# EAGLE design light-plate_leds_v1.0 (EAGLE 6.2)

## Sheet 1 of 4
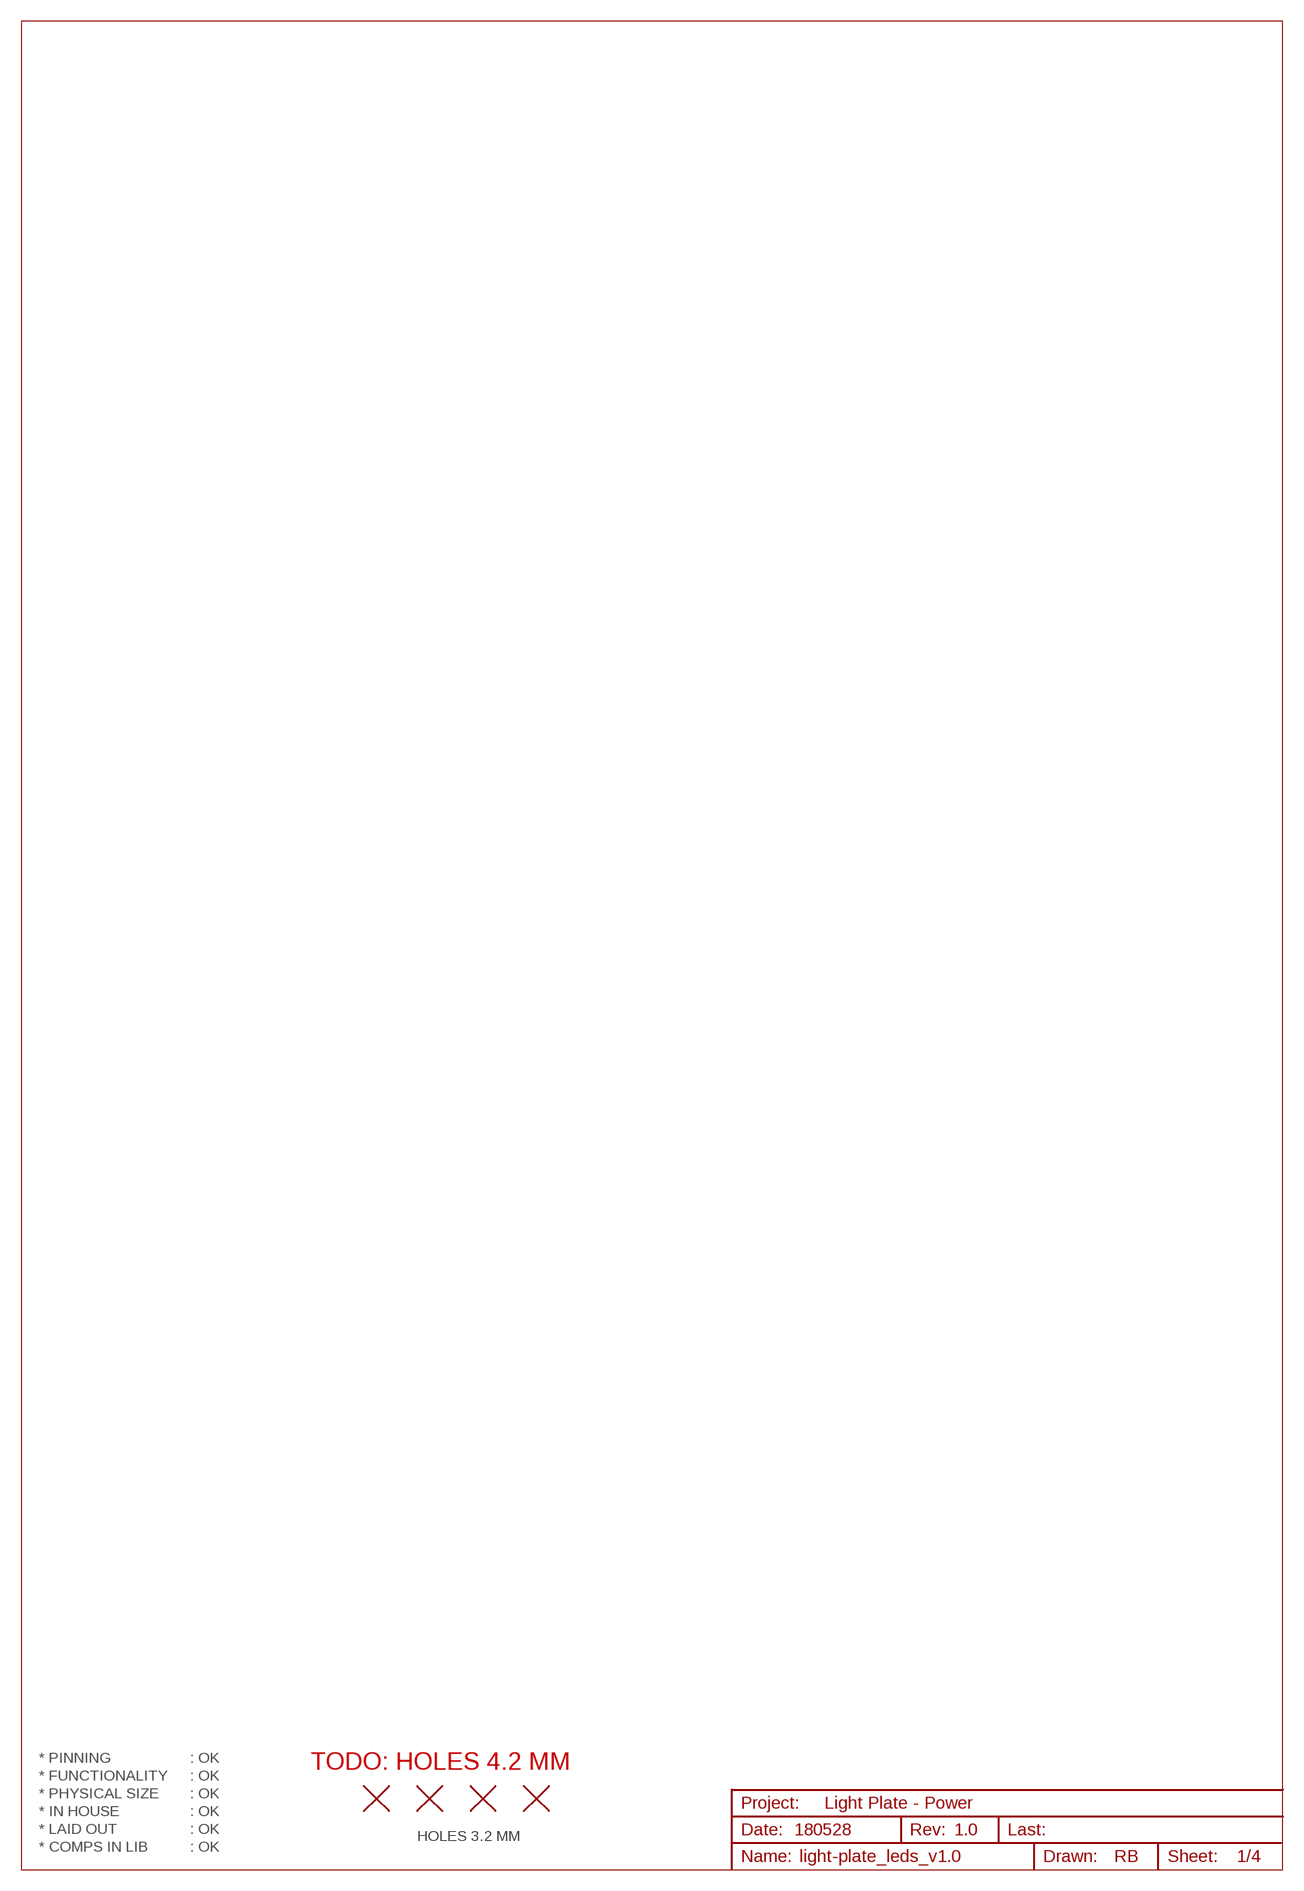
[diagram p0: schematic, sheet 1]

### Parts
H1  HOLE_NPTH_3.2MM  [HOLE_NPTH_3.2MM]
H2  HOLE_NPTH_3.2MM  [HOLE_NPTH_3.2MM]
H3  HOLE_NPTH_3.2MM  [HOLE_NPTH_3.2MM]
H4  HOLE_NPTH_3.2MM  [HOLE_NPTH_3.2MM]

### Notes on the sheet
- * PINNING | : OK
- TODO: HOLES 4.2 MM
- * FUNCTIONALITY | : OK
- * PHYSICAL SIZE | : OK
- Light Plate - Power
- * IN HOUSE | : OK
- * LAID OUT | : OK | 180528 | 1.0
- HOLES 3.2 MM
- * COMPS IN LIB | : OK

## Sheet 2 of 4
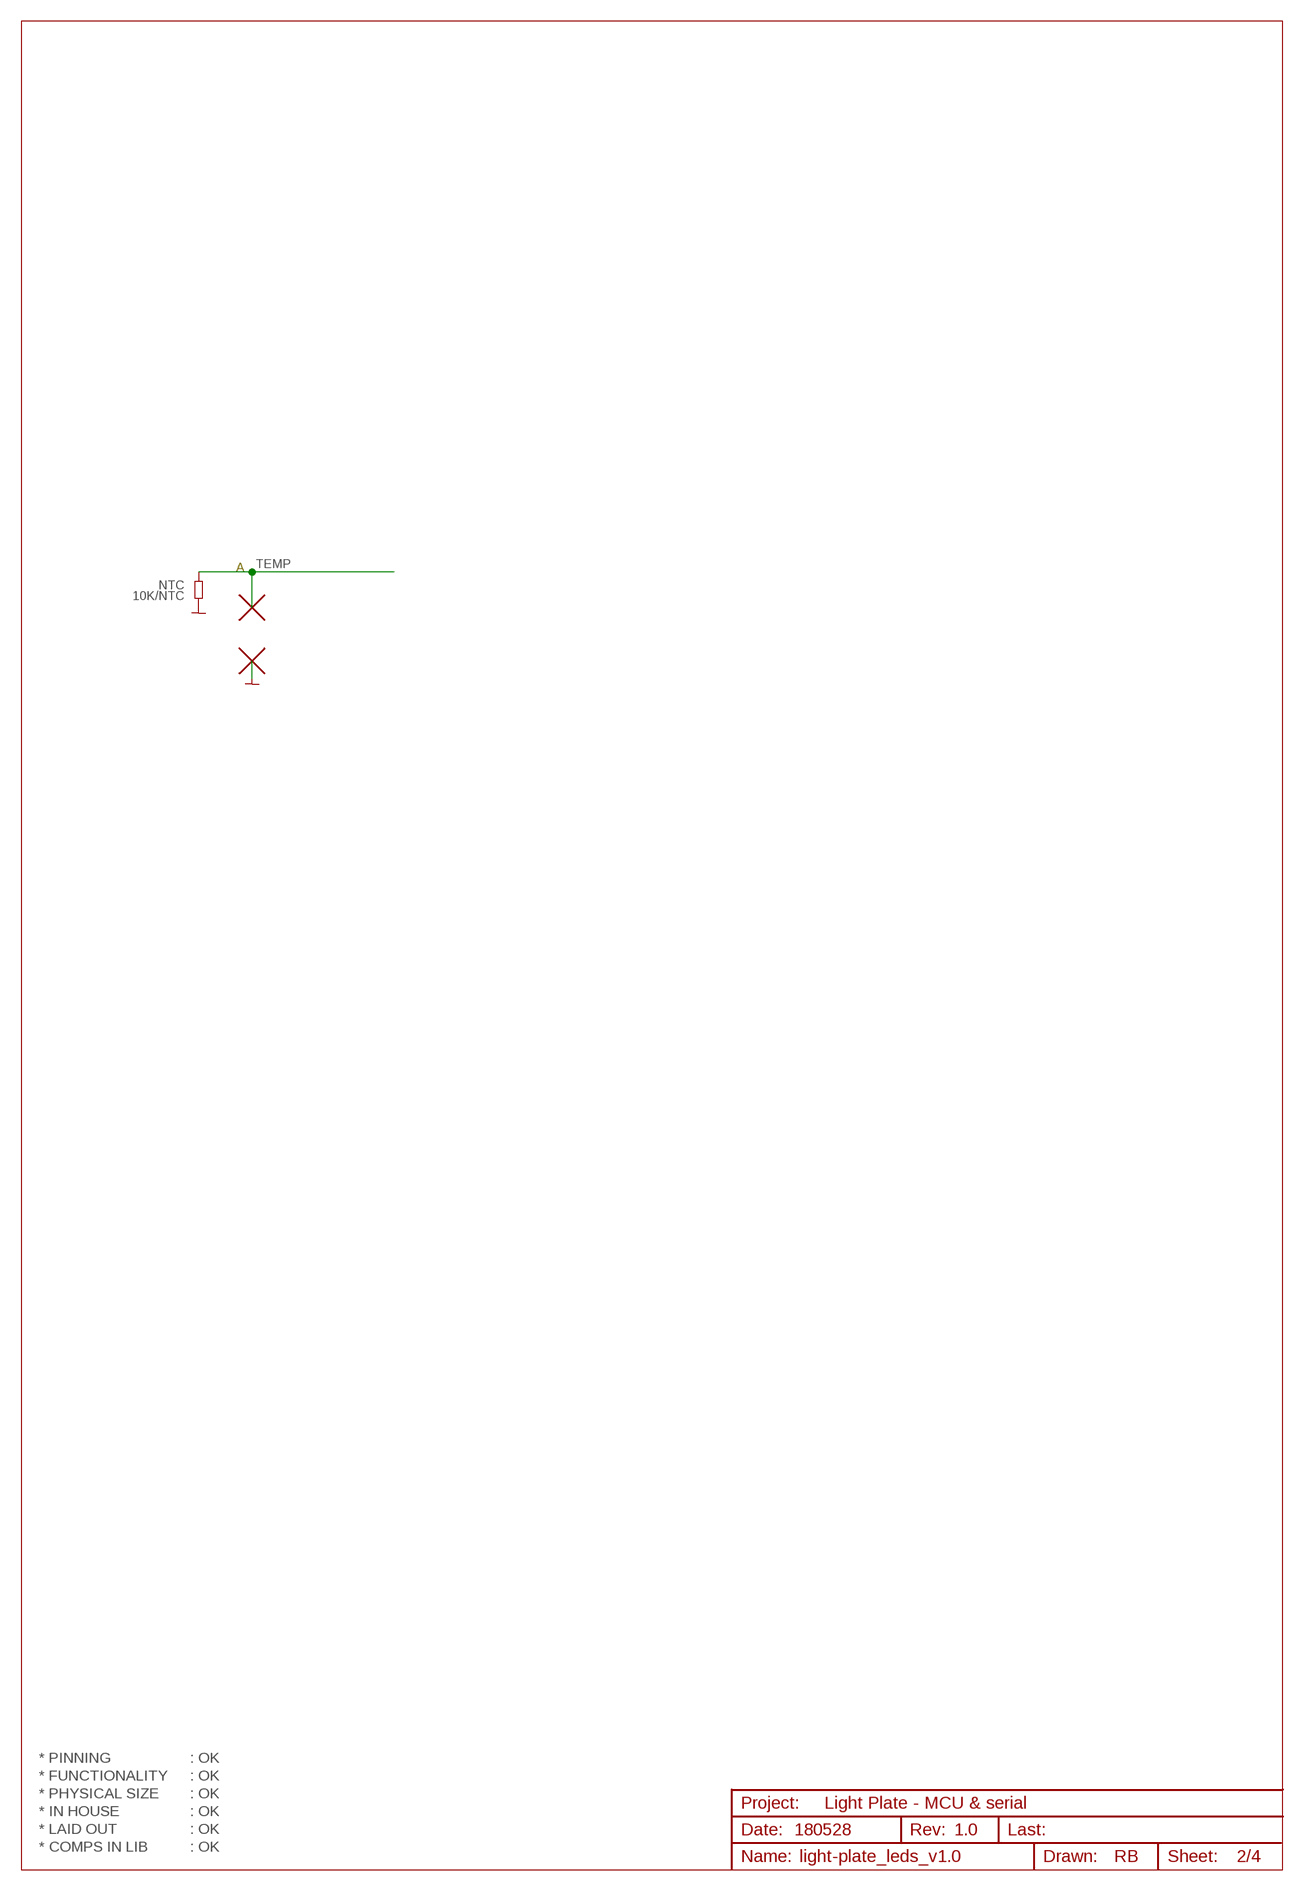
[diagram p1: schematic, sheet 2]

### Parts
H11  PAD_ROUND_1.6MM  [PAD_ROUND_1.6MM]
H12  PAD_ROUND_1.6MM  [PAD_ROUND_1.6MM]
NTC  10K/NTC  RES0603  [RES0603]

### Nets
GND: H11.P NTC.1
TEMP: H12.P NTC.2

### Notes on the sheet
- A
- * PINNING | : OK
- * FUNCTIONALITY | : OK
- * PHYSICAL SIZE | : OK
- Light Plate - MCU & serial
- * IN HOUSE | : OK
- * LAID OUT | : OK | 180528 | 1.0
- * COMPS IN LIB | : OK

## Sheet 3 of 4
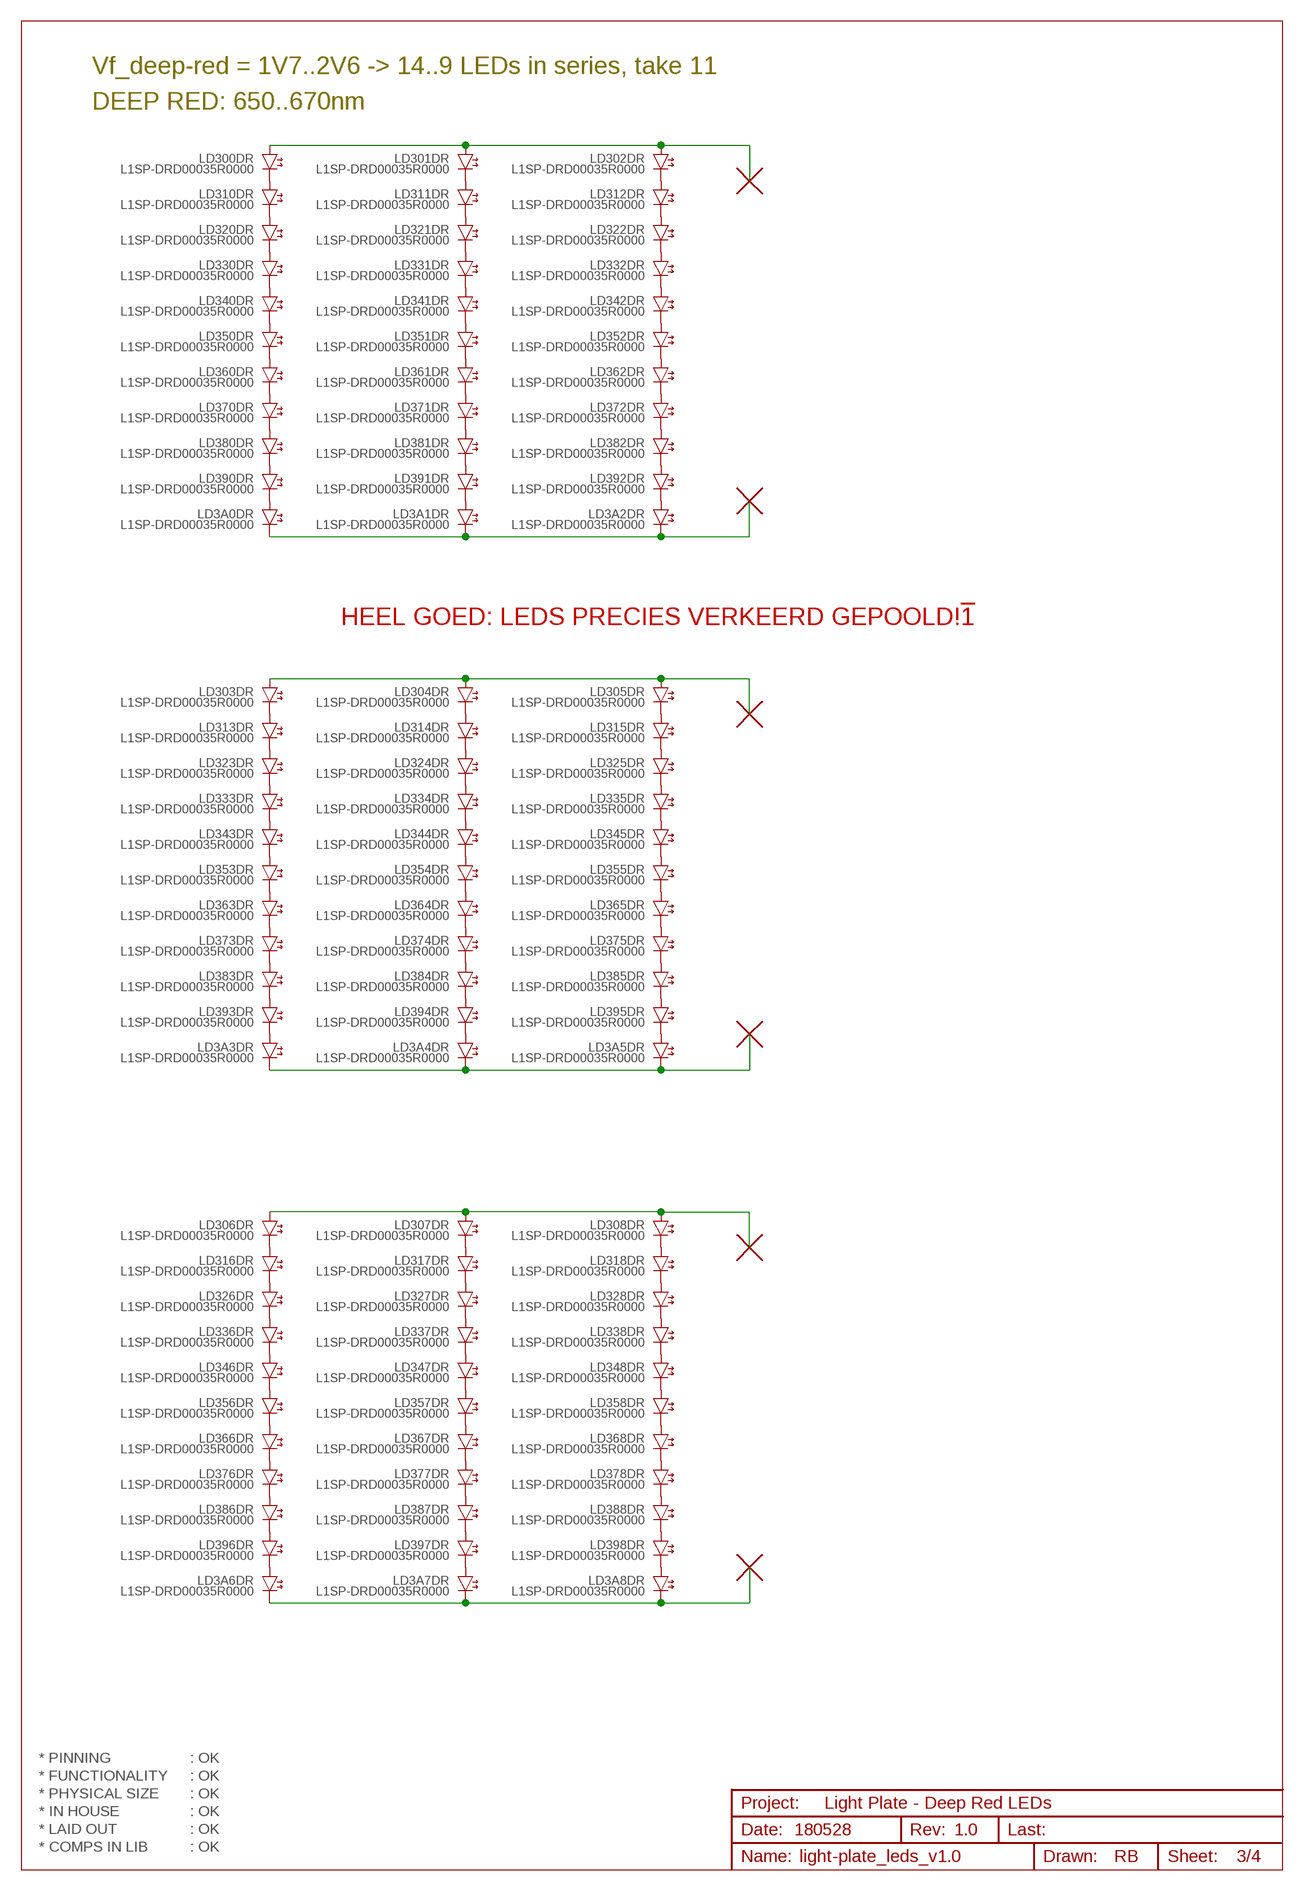
[diagram p2: schematic, sheet 3]

### Parts
H17  PAD_ROUND_3.2MM  [PAD_ROUND_3.2MM]
H18  PAD_ROUND_3.2MM  [PAD_ROUND_3.2MM]
H19  PAD_ROUND_3.2MM  [PAD_ROUND_3.2MM]
H20  PAD_ROUND_3.2MM  [PAD_ROUND_3.2MM]
H21  PAD_ROUND_3.2MM  [PAD_ROUND_3.2MM]
H22  PAD_ROUND_3.2MM  [PAD_ROUND_3.2MM]
LD3A0DR  L1SP-DRD00035R0000  LED_SMD_SUNPLUS35_REVERSED  [LED_SMD_SUNPLUS35_REVERSED]
LD3A1DR  L1SP-DRD00035R0000  LED_SMD_SUNPLUS35_REVERSED  [LED_SMD_SUNPLUS35_REVERSED]
LD3A2DR  L1SP-DRD00035R0000  LED_SMD_SUNPLUS35_REVERSED  [LED_SMD_SUNPLUS35_REVERSED]
LD3A3DR  L1SP-DRD00035R0000  LED_SMD_SUNPLUS35_REVERSED  [LED_SMD_SUNPLUS35_REVERSED]
LD3A4DR  L1SP-DRD00035R0000  LED_SMD_SUNPLUS35_REVERSED  [LED_SMD_SUNPLUS35_REVERSED]
LD3A5DR  L1SP-DRD00035R0000  LED_SMD_SUNPLUS35_REVERSED  [LED_SMD_SUNPLUS35_REVERSED]
LD3A6DR  L1SP-DRD00035R0000  LED_SMD_SUNPLUS35_REVERSED  [LED_SMD_SUNPLUS35_REVERSED]
LD3A7DR  L1SP-DRD00035R0000  LED_SMD_SUNPLUS35_REVERSED  [LED_SMD_SUNPLUS35_REVERSED]
LD3A8DR  L1SP-DRD00035R0000  LED_SMD_SUNPLUS35_REVERSED  [LED_SMD_SUNPLUS35_REVERSED]
LD300DR  L1SP-DRD00035R0000  LED_SMD_SUNPLUS35_REVERSED  [LED_SMD_SUNPLUS35_REVERSED]
LD301DR  L1SP-DRD00035R0000  LED_SMD_SUNPLUS35_REVERSED  [LED_SMD_SUNPLUS35_REVERSED]
LD302DR  L1SP-DRD00035R0000  LED_SMD_SUNPLUS35_REVERSED  [LED_SMD_SUNPLUS35_REVERSED]
LD303DR  L1SP-DRD00035R0000  LED_SMD_SUNPLUS35_REVERSED  [LED_SMD_SUNPLUS35_REVERSED]
LD304DR  L1SP-DRD00035R0000  LED_SMD_SUNPLUS35_REVERSED  [LED_SMD_SUNPLUS35_REVERSED]
LD305DR  L1SP-DRD00035R0000  LED_SMD_SUNPLUS35_REVERSED  [LED_SMD_SUNPLUS35_REVERSED]
LD306DR  L1SP-DRD00035R0000  LED_SMD_SUNPLUS35_REVERSED  [LED_SMD_SUNPLUS35_REVERSED]
LD307DR  L1SP-DRD00035R0000  LED_SMD_SUNPLUS35_REVERSED  [LED_SMD_SUNPLUS35_REVERSED]
LD308DR  L1SP-DRD00035R0000  LED_SMD_SUNPLUS35_REVERSED  [LED_SMD_SUNPLUS35_REVERSED]
LD310DR  L1SP-DRD00035R0000  LED_SMD_SUNPLUS35_REVERSED  [LED_SMD_SUNPLUS35_REVERSED]
LD311DR  L1SP-DRD00035R0000  LED_SMD_SUNPLUS35_REVERSED  [LED_SMD_SUNPLUS35_REVERSED]
LD312DR  L1SP-DRD00035R0000  LED_SMD_SUNPLUS35_REVERSED  [LED_SMD_SUNPLUS35_REVERSED]
LD313DR  L1SP-DRD00035R0000  LED_SMD_SUNPLUS35_REVERSED  [LED_SMD_SUNPLUS35_REVERSED]
LD314DR  L1SP-DRD00035R0000  LED_SMD_SUNPLUS35_REVERSED  [LED_SMD_SUNPLUS35_REVERSED]
LD315DR  L1SP-DRD00035R0000  LED_SMD_SUNPLUS35_REVERSED  [LED_SMD_SUNPLUS35_REVERSED]
LD316DR  L1SP-DRD00035R0000  LED_SMD_SUNPLUS35_REVERSED  [LED_SMD_SUNPLUS35_REVERSED]
LD317DR  L1SP-DRD00035R0000  LED_SMD_SUNPLUS35_REVERSED  [LED_SMD_SUNPLUS35_REVERSED]
LD318DR  L1SP-DRD00035R0000  LED_SMD_SUNPLUS35_REVERSED  [LED_SMD_SUNPLUS35_REVERSED]
LD320DR  L1SP-DRD00035R0000  LED_SMD_SUNPLUS35_REVERSED  [LED_SMD_SUNPLUS35_REVERSED]
LD321DR  L1SP-DRD00035R0000  LED_SMD_SUNPLUS35_REVERSED  [LED_SMD_SUNPLUS35_REVERSED]
LD322DR  L1SP-DRD00035R0000  LED_SMD_SUNPLUS35_REVERSED  [LED_SMD_SUNPLUS35_REVERSED]
LD323DR  L1SP-DRD00035R0000  LED_SMD_SUNPLUS35_REVERSED  [LED_SMD_SUNPLUS35_REVERSED]
LD324DR  L1SP-DRD00035R0000  LED_SMD_SUNPLUS35_REVERSED  [LED_SMD_SUNPLUS35_REVERSED]
LD325DR  L1SP-DRD00035R0000  LED_SMD_SUNPLUS35_REVERSED  [LED_SMD_SUNPLUS35_REVERSED]
LD326DR  L1SP-DRD00035R0000  LED_SMD_SUNPLUS35_REVERSED  [LED_SMD_SUNPLUS35_REVERSED]
LD327DR  L1SP-DRD00035R0000  LED_SMD_SUNPLUS35_REVERSED  [LED_SMD_SUNPLUS35_REVERSED]
LD328DR  L1SP-DRD00035R0000  LED_SMD_SUNPLUS35_REVERSED  [LED_SMD_SUNPLUS35_REVERSED]
LD330DR  L1SP-DRD00035R0000  LED_SMD_SUNPLUS35_REVERSED  [LED_SMD_SUNPLUS35_REVERSED]
LD331DR  L1SP-DRD00035R0000  LED_SMD_SUNPLUS35_REVERSED  [LED_SMD_SUNPLUS35_REVERSED]
LD332DR  L1SP-DRD00035R0000  LED_SMD_SUNPLUS35_REVERSED  [LED_SMD_SUNPLUS35_REVERSED]
LD333DR  L1SP-DRD00035R0000  LED_SMD_SUNPLUS35_REVERSED  [LED_SMD_SUNPLUS35_REVERSED]
LD334DR  L1SP-DRD00035R0000  LED_SMD_SUNPLUS35_REVERSED  [LED_SMD_SUNPLUS35_REVERSED]
LD335DR  L1SP-DRD00035R0000  LED_SMD_SUNPLUS35_REVERSED  [LED_SMD_SUNPLUS35_REVERSED]
LD336DR  L1SP-DRD00035R0000  LED_SMD_SUNPLUS35_REVERSED  [LED_SMD_SUNPLUS35_REVERSED]
LD337DR  L1SP-DRD00035R0000  LED_SMD_SUNPLUS35_REVERSED  [LED_SMD_SUNPLUS35_REVERSED]
LD338DR  L1SP-DRD00035R0000  LED_SMD_SUNPLUS35_REVERSED  [LED_SMD_SUNPLUS35_REVERSED]
LD340DR  L1SP-DRD00035R0000  LED_SMD_SUNPLUS35_REVERSED  [LED_SMD_SUNPLUS35_REVERSED]
LD341DR  L1SP-DRD00035R0000  LED_SMD_SUNPLUS35_REVERSED  [LED_SMD_SUNPLUS35_REVERSED]
LD342DR  L1SP-DRD00035R0000  LED_SMD_SUNPLUS35_REVERSED  [LED_SMD_SUNPLUS35_REVERSED]
LD343DR  L1SP-DRD00035R0000  LED_SMD_SUNPLUS35_REVERSED  [LED_SMD_SUNPLUS35_REVERSED]
LD344DR  L1SP-DRD00035R0000  LED_SMD_SUNPLUS35_REVERSED  [LED_SMD_SUNPLUS35_REVERSED]
LD345DR  L1SP-DRD00035R0000  LED_SMD_SUNPLUS35_REVERSED  [LED_SMD_SUNPLUS35_REVERSED]
LD346DR  L1SP-DRD00035R0000  LED_SMD_SUNPLUS35_REVERSED  [LED_SMD_SUNPLUS35_REVERSED]
LD347DR  L1SP-DRD00035R0000  LED_SMD_SUNPLUS35_REVERSED  [LED_SMD_SUNPLUS35_REVERSED]
LD348DR  L1SP-DRD00035R0000  LED_SMD_SUNPLUS35_REVERSED  [LED_SMD_SUNPLUS35_REVERSED]
LD350DR  L1SP-DRD00035R0000  LED_SMD_SUNPLUS35_REVERSED  [LED_SMD_SUNPLUS35_REVERSED]
LD351DR  L1SP-DRD00035R0000  LED_SMD_SUNPLUS35_REVERSED  [LED_SMD_SUNPLUS35_REVERSED]
LD352DR  L1SP-DRD00035R0000  LED_SMD_SUNPLUS35_REVERSED  [LED_SMD_SUNPLUS35_REVERSED]
LD353DR  L1SP-DRD00035R0000  LED_SMD_SUNPLUS35_REVERSED  [LED_SMD_SUNPLUS35_REVERSED]
LD354DR  L1SP-DRD00035R0000  LED_SMD_SUNPLUS35_REVERSED  [LED_SMD_SUNPLUS35_REVERSED]
LD355DR  L1SP-DRD00035R0000  LED_SMD_SUNPLUS35_REVERSED  [LED_SMD_SUNPLUS35_REVERSED]
LD356DR  L1SP-DRD00035R0000  LED_SMD_SUNPLUS35_REVERSED  [LED_SMD_SUNPLUS35_REVERSED]
LD357DR  L1SP-DRD00035R0000  LED_SMD_SUNPLUS35_REVERSED  [LED_SMD_SUNPLUS35_REVERSED]
LD358DR  L1SP-DRD00035R0000  LED_SMD_SUNPLUS35_REVERSED  [LED_SMD_SUNPLUS35_REVERSED]
LD360DR  L1SP-DRD00035R0000  LED_SMD_SUNPLUS35_REVERSED  [LED_SMD_SUNPLUS35_REVERSED]
LD361DR  L1SP-DRD00035R0000  LED_SMD_SUNPLUS35_REVERSED  [LED_SMD_SUNPLUS35_REVERSED]
LD362DR  L1SP-DRD00035R0000  LED_SMD_SUNPLUS35_REVERSED  [LED_SMD_SUNPLUS35_REVERSED]
LD363DR  L1SP-DRD00035R0000  LED_SMD_SUNPLUS35_REVERSED  [LED_SMD_SUNPLUS35_REVERSED]
LD364DR  L1SP-DRD00035R0000  LED_SMD_SUNPLUS35_REVERSED  [LED_SMD_SUNPLUS35_REVERSED]
LD365DR  L1SP-DRD00035R0000  LED_SMD_SUNPLUS35_REVERSED  [LED_SMD_SUNPLUS35_REVERSED]
LD366DR  L1SP-DRD00035R0000  LED_SMD_SUNPLUS35_REVERSED  [LED_SMD_SUNPLUS35_REVERSED]
LD367DR  L1SP-DRD00035R0000  LED_SMD_SUNPLUS35_REVERSED  [LED_SMD_SUNPLUS35_REVERSED]
LD368DR  L1SP-DRD00035R0000  LED_SMD_SUNPLUS35_REVERSED  [LED_SMD_SUNPLUS35_REVERSED]
LD370DR  L1SP-DRD00035R0000  LED_SMD_SUNPLUS35_REVERSED  [LED_SMD_SUNPLUS35_REVERSED]
LD371DR  L1SP-DRD00035R0000  LED_SMD_SUNPLUS35_REVERSED  [LED_SMD_SUNPLUS35_REVERSED]
LD372DR  L1SP-DRD00035R0000  LED_SMD_SUNPLUS35_REVERSED  [LED_SMD_SUNPLUS35_REVERSED]
LD373DR  L1SP-DRD00035R0000  LED_SMD_SUNPLUS35_REVERSED  [LED_SMD_SUNPLUS35_REVERSED]
LD374DR  L1SP-DRD00035R0000  LED_SMD_SUNPLUS35_REVERSED  [LED_SMD_SUNPLUS35_REVERSED]
LD375DR  L1SP-DRD00035R0000  LED_SMD_SUNPLUS35_REVERSED  [LED_SMD_SUNPLUS35_REVERSED]
LD376DR  L1SP-DRD00035R0000  LED_SMD_SUNPLUS35_REVERSED  [LED_SMD_SUNPLUS35_REVERSED]
LD377DR  L1SP-DRD00035R0000  LED_SMD_SUNPLUS35_REVERSED  [LED_SMD_SUNPLUS35_REVERSED]
LD378DR  L1SP-DRD00035R0000  LED_SMD_SUNPLUS35_REVERSED  [LED_SMD_SUNPLUS35_REVERSED]
LD380DR  L1SP-DRD00035R0000  LED_SMD_SUNPLUS35_REVERSED  [LED_SMD_SUNPLUS35_REVERSED]
LD381DR  L1SP-DRD00035R0000  LED_SMD_SUNPLUS35_REVERSED  [LED_SMD_SUNPLUS35_REVERSED]
LD382DR  L1SP-DRD00035R0000  LED_SMD_SUNPLUS35_REVERSED  [LED_SMD_SUNPLUS35_REVERSED]
LD383DR  L1SP-DRD00035R0000  LED_SMD_SUNPLUS35_REVERSED  [LED_SMD_SUNPLUS35_REVERSED]
LD384DR  L1SP-DRD00035R0000  LED_SMD_SUNPLUS35_REVERSED  [LED_SMD_SUNPLUS35_REVERSED]
LD385DR  L1SP-DRD00035R0000  LED_SMD_SUNPLUS35_REVERSED  [LED_SMD_SUNPLUS35_REVERSED]
LD386DR  L1SP-DRD00035R0000  LED_SMD_SUNPLUS35_REVERSED  [LED_SMD_SUNPLUS35_REVERSED]
LD387DR  L1SP-DRD00035R0000  LED_SMD_SUNPLUS35_REVERSED  [LED_SMD_SUNPLUS35_REVERSED]
LD388DR  L1SP-DRD00035R0000  LED_SMD_SUNPLUS35_REVERSED  [LED_SMD_SUNPLUS35_REVERSED]
LD390DR  L1SP-DRD00035R0000  LED_SMD_SUNPLUS35_REVERSED  [LED_SMD_SUNPLUS35_REVERSED]
LD391DR  L1SP-DRD00035R0000  LED_SMD_SUNPLUS35_REVERSED  [LED_SMD_SUNPLUS35_REVERSED]
LD392DR  L1SP-DRD00035R0000  LED_SMD_SUNPLUS35_REVERSED  [LED_SMD_SUNPLUS35_REVERSED]
LD393DR  L1SP-DRD00035R0000  LED_SMD_SUNPLUS35_REVERSED  [LED_SMD_SUNPLUS35_REVERSED]
LD394DR  L1SP-DRD00035R0000  LED_SMD_SUNPLUS35_REVERSED  [LED_SMD_SUNPLUS35_REVERSED]
LD395DR  L1SP-DRD00035R0000  LED_SMD_SUNPLUS35_REVERSED  [LED_SMD_SUNPLUS35_REVERSED]
LD396DR  L1SP-DRD00035R0000  LED_SMD_SUNPLUS35_REVERSED  [LED_SMD_SUNPLUS35_REVERSED]
LD397DR  L1SP-DRD00035R0000  LED_SMD_SUNPLUS35_REVERSED  [LED_SMD_SUNPLUS35_REVERSED]
LD398DR  L1SP-DRD00035R0000  LED_SMD_SUNPLUS35_REVERSED  [LED_SMD_SUNPLUS35_REVERSED]

### Nets
N$15: LD300DR.A(-) LD310DR.C(+)
N$16: LD310DR.A(-) LD320DR.C(+)
N$17: LD320DR.A(-) LD330DR.C(+)
N$18: LD330DR.A(-) LD340DR.C(+)
N$19: LD340DR.A(-) LD350DR.C(+)
N$20: LD350DR.A(-) LD360DR.C(+)
N$21: LD360DR.A(-) LD370DR.C(+)
N$22: LD370DR.A(-) LD380DR.C(+)
N$23: LD380DR.A(-) LD390DR.C(+)
N$24: LD3A0DR.C(+) LD390DR.A(-)
N$26: LD301DR.A(-) LD311DR.C(+)
N$27: LD311DR.A(-) LD321DR.C(+)
N$28: LD321DR.A(-) LD331DR.C(+)
N$29: LD331DR.A(-) LD341DR.C(+)
N$30: LD341DR.A(-) LD351DR.C(+)
N$31: LD351DR.A(-) LD361DR.C(+)
N$32: LD361DR.A(-) LD371DR.C(+)
N$33: LD371DR.A(-) LD381DR.C(+)
N$34: LD381DR.A(-) LD391DR.C(+)
N$35: LD3A1DR.C(+) LD391DR.A(-)
N$36: LD302DR.A(-) LD312DR.C(+)
N$37: LD312DR.A(-) LD322DR.C(+)
N$38: LD322DR.A(-) LD332DR.C(+)
N$39: LD332DR.A(-) LD342DR.C(+)
N$40: LD342DR.A(-) LD352DR.C(+)
N$41: LD352DR.A(-) LD362DR.C(+)
N$42: LD362DR.A(-) LD372DR.C(+)
N$43: LD372DR.A(-) LD382DR.C(+)
N$44: LD382DR.A(-) LD392DR.C(+)
N$45: LD3A2DR.C(+) LD392DR.A(-)
N$46: LD303DR.A(-) LD313DR.C(+)
N$47: LD313DR.A(-) LD323DR.C(+)
N$48: LD323DR.A(-) LD333DR.C(+)
N$49: LD333DR.A(-) LD343DR.C(+)
N$50: LD343DR.A(-) LD353DR.C(+)
N$51: LD353DR.A(-) LD363DR.C(+)
N$52: LD363DR.A(-) LD373DR.C(+)
N$53: LD373DR.A(-) LD383DR.C(+)
N$54: LD383DR.A(-) LD393DR.C(+)
N$55: LD3A3DR.C(+) LD393DR.A(-)
N$56: LD304DR.A(-) LD314DR.C(+)
N$57: LD314DR.A(-) LD324DR.C(+)
N$58: LD324DR.A(-) LD334DR.C(+)
N$59: LD334DR.A(-) LD344DR.C(+)
N$60: LD344DR.A(-) LD354DR.C(+)
N$61: LD354DR.A(-) LD364DR.C(+)
N$62: LD364DR.A(-) LD374DR.C(+)
N$63: LD374DR.A(-) LD384DR.C(+)
N$64: LD384DR.A(-) LD394DR.C(+)
N$65: LD3A4DR.C(+) LD394DR.A(-)
N$66: LD305DR.A(-) LD315DR.C(+)
N$67: LD315DR.A(-) LD325DR.C(+)
N$68: LD325DR.A(-) LD335DR.C(+)
N$69: LD335DR.A(-) LD345DR.C(+)
N$70: LD345DR.A(-) LD355DR.C(+)
N$71: LD355DR.A(-) LD365DR.C(+)
N$72: LD365DR.A(-) LD375DR.C(+)
N$73: LD375DR.A(-) LD385DR.C(+)
N$74: LD385DR.A(-) LD395DR.C(+)
N$75: LD3A5DR.C(+) LD395DR.A(-)
N$76: LD306DR.A(-) LD316DR.C(+)
N$77: LD316DR.A(-) LD326DR.C(+)
N$78: LD326DR.A(-) LD336DR.C(+)
N$79: LD336DR.A(-) LD346DR.C(+)
N$80: LD346DR.A(-) LD356DR.C(+)
N$81: LD356DR.A(-) LD366DR.C(+)
N$82: LD366DR.A(-) LD376DR.C(+)
N$83: LD376DR.A(-) LD386DR.C(+)
N$84: LD386DR.A(-) LD396DR.C(+)
N$85: LD3A6DR.C(+) LD396DR.A(-)
N$86: LD307DR.A(-) LD317DR.C(+)
N$87: LD317DR.A(-) LD327DR.C(+)
N$88: LD327DR.A(-) LD337DR.C(+)
N$89: LD337DR.A(-) LD347DR.C(+)
N$90: LD347DR.A(-) LD357DR.C(+)
N$91: LD357DR.A(-) LD367DR.C(+)
N$92: LD367DR.A(-) LD377DR.C(+)
N$93: LD377DR.A(-) LD387DR.C(+)
N$94: LD387DR.A(-) LD397DR.C(+)
N$95: LD3A7DR.C(+) LD397DR.A(-)
N$96: LD308DR.A(-) LD318DR.C(+)
N$97: LD318DR.A(-) LD328DR.C(+)
N$98: LD328DR.A(-) LD338DR.C(+)
N$99: LD338DR.A(-) LD348DR.C(+)
N$100: LD348DR.A(-) LD358DR.C(+)
N$101: LD358DR.A(-) LD368DR.C(+)
N$102: LD368DR.A(-) LD378DR.C(+)
N$103: LD378DR.A(-) LD388DR.C(+)
N$104: LD388DR.A(-) LD398DR.C(+)
N$105: LD3A8DR.C(+) LD398DR.A(-)
N$138: H18.P LD3A0DR.A(-) LD3A1DR.A(-) LD3A2DR.A(-)
N$142: H20.P LD3A3DR.A(-) LD3A4DR.A(-) LD3A5DR.A(-)
N$144: H22.P LD3A6DR.A(-) LD3A7DR.A(-) LD3A8DR.A(-)
N$148: H17.P LD300DR.C(+) LD301DR.C(+) LD302DR.C(+)
N$152: H19.P LD303DR.C(+) LD304DR.C(+) LD305DR.C(+)
N$163: H21.P LD306DR.C(+) LD307DR.C(+) LD308DR.C(+)

### Notes on the sheet
- Vf_deep-red = 1V7..2V6 -> 14..9 LEDs in series, take 11
- DEEP RED: 650..670nm
- HEEL GOED: LEDS PRECIES VERKEERD GEPOOLD!!1!
- * PINNING | : OK
- * FUNCTIONALITY | : OK
- * PHYSICAL SIZE | : OK
- Light Plate - Deep Red LEDs
- * IN HOUSE | : OK
- * LAID OUT | : OK | 180528 | 1.0
- * COMPS IN LIB | : OK

## Sheet 4 of 4
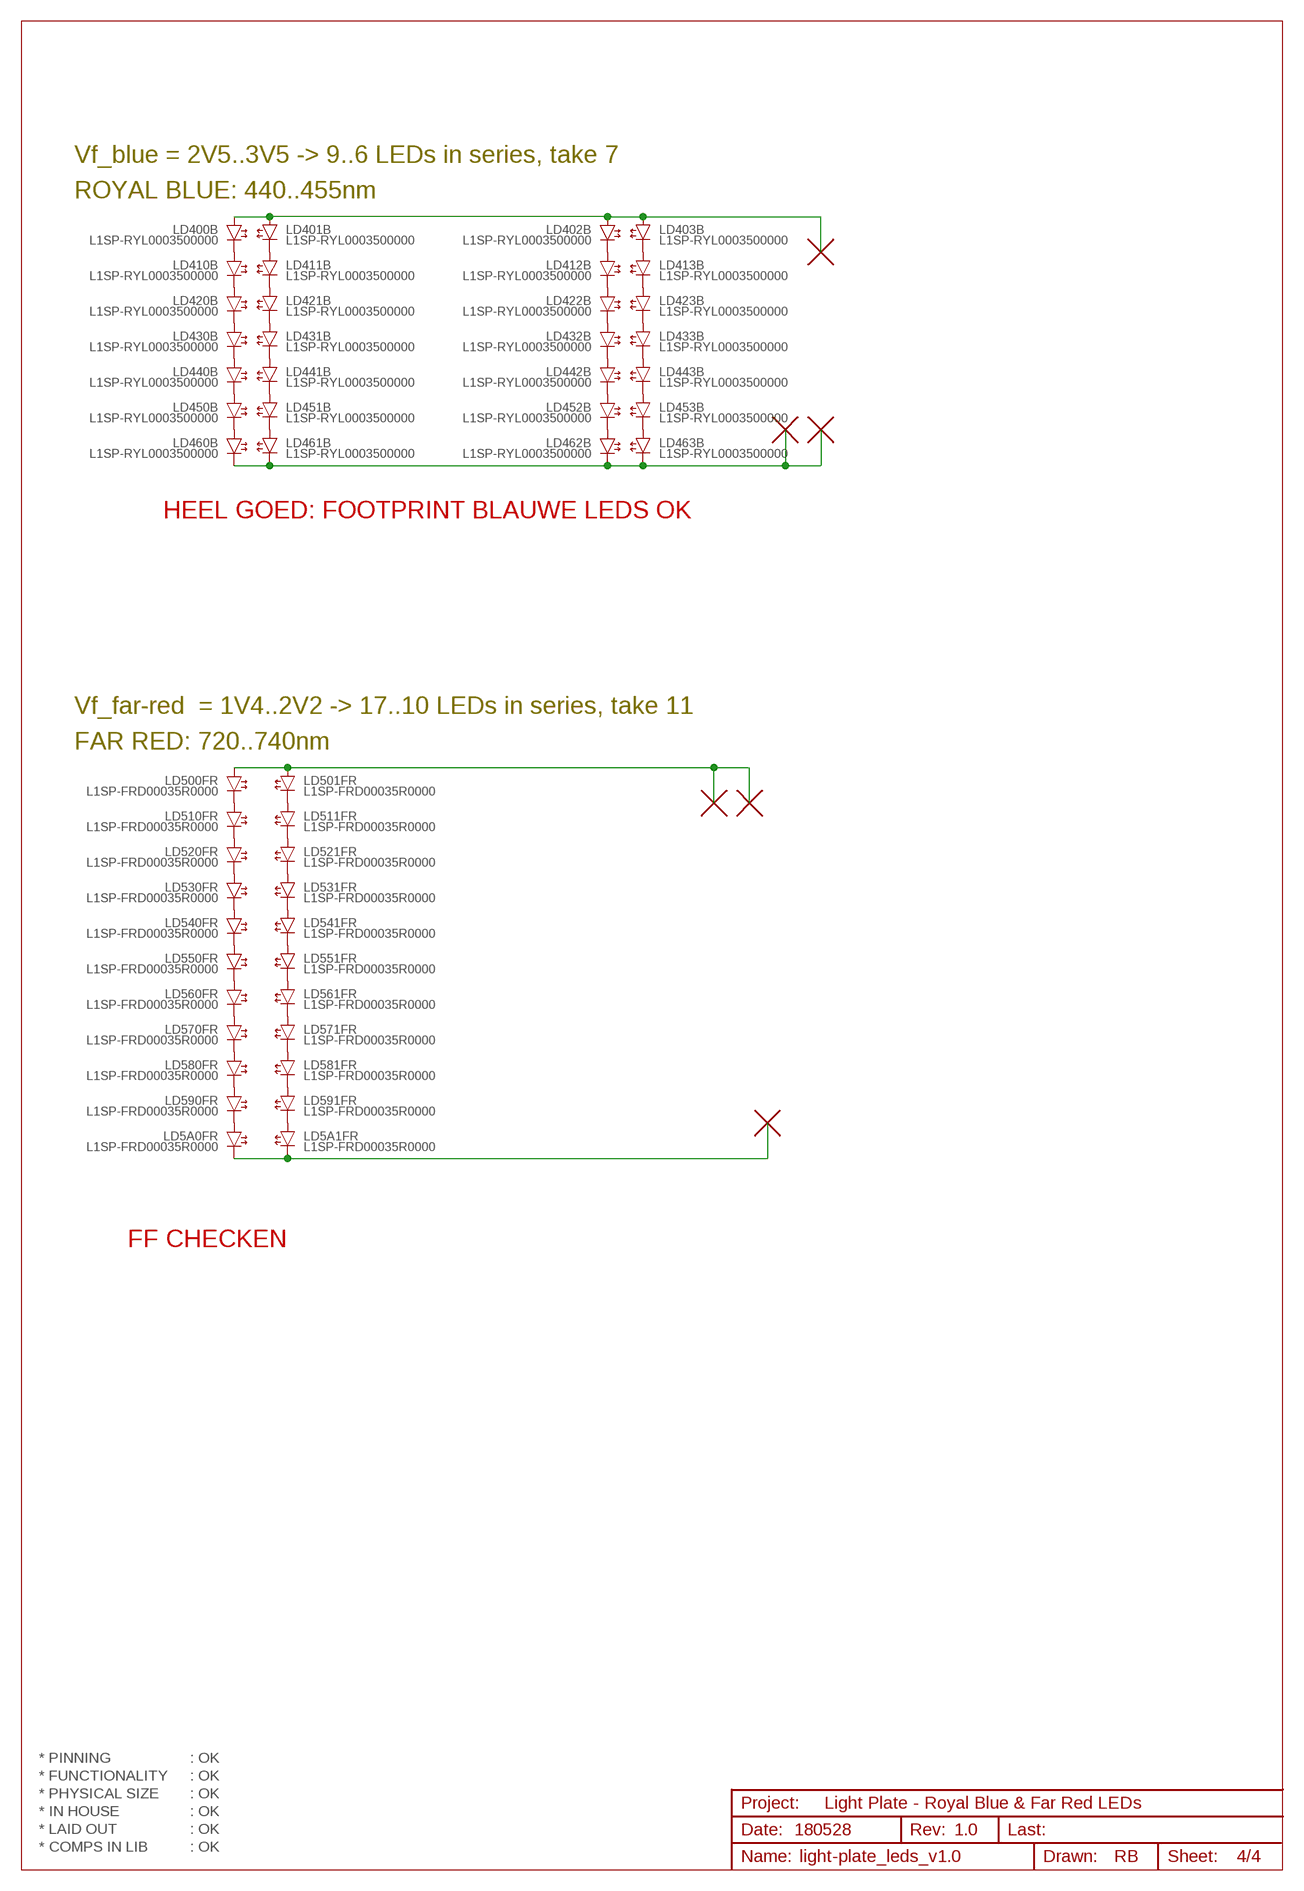
[diagram p3: schematic, sheet 4]

### Parts
H23  PAD_ROUND_3.2MM  [PAD_ROUND_3.2MM]
H24  PAD_ROUND_3.2MM  [PAD_ROUND_3.2MM]
H25  PAD_ROUND_3.2MM  [PAD_ROUND_3.2MM]
H26  PAD_ROUND_3.2MM  [PAD_ROUND_3.2MM]
H27  PAD_ROUND_3.2MM  [PAD_ROUND_3.2MM]
H28  PAD_ROUND_3.2MM  [PAD_ROUND_3.2MM]
LD5A0FR  L1SP-FRD00035R0000  LED_SMD_SUNPLUS35_REVERSED  [LED_SMD_SUNPLUS35_REVERSED]
LD5A1FR  L1SP-FRD00035R0000  LED_SMD_SUNPLUS35_REVERSED  [LED_SMD_SUNPLUS35_REVERSED]
LD400B  L1SP-RYL0003500000  LED_SMD_SUNPLUS35  [LED_SMD_SUNPLUS35]
LD401B  L1SP-RYL0003500000  LED_SMD_SUNPLUS35  [LED_SMD_SUNPLUS35]
LD402B  L1SP-RYL0003500000  LED_SMD_SUNPLUS35  [LED_SMD_SUNPLUS35]
LD403B  L1SP-RYL0003500000  LED_SMD_SUNPLUS35  [LED_SMD_SUNPLUS35]
LD410B  L1SP-RYL0003500000  LED_SMD_SUNPLUS35  [LED_SMD_SUNPLUS35]
LD411B  L1SP-RYL0003500000  LED_SMD_SUNPLUS35  [LED_SMD_SUNPLUS35]
LD412B  L1SP-RYL0003500000  LED_SMD_SUNPLUS35  [LED_SMD_SUNPLUS35]
LD413B  L1SP-RYL0003500000  LED_SMD_SUNPLUS35  [LED_SMD_SUNPLUS35]
LD420B  L1SP-RYL0003500000  LED_SMD_SUNPLUS35  [LED_SMD_SUNPLUS35]
LD421B  L1SP-RYL0003500000  LED_SMD_SUNPLUS35  [LED_SMD_SUNPLUS35]
LD422B  L1SP-RYL0003500000  LED_SMD_SUNPLUS35  [LED_SMD_SUNPLUS35]
LD423B  L1SP-RYL0003500000  LED_SMD_SUNPLUS35  [LED_SMD_SUNPLUS35]
LD430B  L1SP-RYL0003500000  LED_SMD_SUNPLUS35  [LED_SMD_SUNPLUS35]
LD431B  L1SP-RYL0003500000  LED_SMD_SUNPLUS35  [LED_SMD_SUNPLUS35]
LD432B  L1SP-RYL0003500000  LED_SMD_SUNPLUS35  [LED_SMD_SUNPLUS35]
LD433B  L1SP-RYL0003500000  LED_SMD_SUNPLUS35  [LED_SMD_SUNPLUS35]
LD440B  L1SP-RYL0003500000  LED_SMD_SUNPLUS35  [LED_SMD_SUNPLUS35]
LD441B  L1SP-RYL0003500000  LED_SMD_SUNPLUS35  [LED_SMD_SUNPLUS35]
LD442B  L1SP-RYL0003500000  LED_SMD_SUNPLUS35  [LED_SMD_SUNPLUS35]
LD443B  L1SP-RYL0003500000  LED_SMD_SUNPLUS35  [LED_SMD_SUNPLUS35]
LD450B  L1SP-RYL0003500000  LED_SMD_SUNPLUS35  [LED_SMD_SUNPLUS35]
LD451B  L1SP-RYL0003500000  LED_SMD_SUNPLUS35  [LED_SMD_SUNPLUS35]
LD452B  L1SP-RYL0003500000  LED_SMD_SUNPLUS35  [LED_SMD_SUNPLUS35]
LD453B  L1SP-RYL0003500000  LED_SMD_SUNPLUS35  [LED_SMD_SUNPLUS35]
LD460B  L1SP-RYL0003500000  LED_SMD_SUNPLUS35  [LED_SMD_SUNPLUS35]
LD461B  L1SP-RYL0003500000  LED_SMD_SUNPLUS35  [LED_SMD_SUNPLUS35]
LD462B  L1SP-RYL0003500000  LED_SMD_SUNPLUS35  [LED_SMD_SUNPLUS35]
LD463B  L1SP-RYL0003500000  LED_SMD_SUNPLUS35  [LED_SMD_SUNPLUS35]
LD500FR  L1SP-FRD00035R0000  LED_SMD_SUNPLUS35_REVERSED  [LED_SMD_SUNPLUS35_REVERSED]
LD501FR  L1SP-FRD00035R0000  LED_SMD_SUNPLUS35_REVERSED  [LED_SMD_SUNPLUS35_REVERSED]
LD510FR  L1SP-FRD00035R0000  LED_SMD_SUNPLUS35_REVERSED  [LED_SMD_SUNPLUS35_REVERSED]
LD511FR  L1SP-FRD00035R0000  LED_SMD_SUNPLUS35_REVERSED  [LED_SMD_SUNPLUS35_REVERSED]
LD520FR  L1SP-FRD00035R0000  LED_SMD_SUNPLUS35_REVERSED  [LED_SMD_SUNPLUS35_REVERSED]
LD521FR  L1SP-FRD00035R0000  LED_SMD_SUNPLUS35_REVERSED  [LED_SMD_SUNPLUS35_REVERSED]
LD530FR  L1SP-FRD00035R0000  LED_SMD_SUNPLUS35_REVERSED  [LED_SMD_SUNPLUS35_REVERSED]
LD531FR  L1SP-FRD00035R0000  LED_SMD_SUNPLUS35_REVERSED  [LED_SMD_SUNPLUS35_REVERSED]
LD540FR  L1SP-FRD00035R0000  LED_SMD_SUNPLUS35_REVERSED  [LED_SMD_SUNPLUS35_REVERSED]
LD541FR  L1SP-FRD00035R0000  LED_SMD_SUNPLUS35_REVERSED  [LED_SMD_SUNPLUS35_REVERSED]
LD550FR  L1SP-FRD00035R0000  LED_SMD_SUNPLUS35_REVERSED  [LED_SMD_SUNPLUS35_REVERSED]
LD551FR  L1SP-FRD00035R0000  LED_SMD_SUNPLUS35_REVERSED  [LED_SMD_SUNPLUS35_REVERSED]
LD560FR  L1SP-FRD00035R0000  LED_SMD_SUNPLUS35_REVERSED  [LED_SMD_SUNPLUS35_REVERSED]
LD561FR  L1SP-FRD00035R0000  LED_SMD_SUNPLUS35_REVERSED  [LED_SMD_SUNPLUS35_REVERSED]
LD570FR  L1SP-FRD00035R0000  LED_SMD_SUNPLUS35_REVERSED  [LED_SMD_SUNPLUS35_REVERSED]
LD571FR  L1SP-FRD00035R0000  LED_SMD_SUNPLUS35_REVERSED  [LED_SMD_SUNPLUS35_REVERSED]
LD580FR  L1SP-FRD00035R0000  LED_SMD_SUNPLUS35_REVERSED  [LED_SMD_SUNPLUS35_REVERSED]
LD581FR  L1SP-FRD00035R0000  LED_SMD_SUNPLUS35_REVERSED  [LED_SMD_SUNPLUS35_REVERSED]
LD590FR  L1SP-FRD00035R0000  LED_SMD_SUNPLUS35_REVERSED  [LED_SMD_SUNPLUS35_REVERSED]
LD591FR  L1SP-FRD00035R0000  LED_SMD_SUNPLUS35_REVERSED  [LED_SMD_SUNPLUS35_REVERSED]

### Nets
N$1: LD402B.C(-) LD412B.A(+)
N$2: LD412B.C(-) LD422B.A(+)
N$4: LD422B.C(-) LD432B.A(+)
N$5: LD432B.C(-) LD442B.A(+)
N$6: LD442B.C(-) LD452B.A(+)
N$7: LD452B.C(-) LD462B.A(+)
N$8: LD403B.C(-) LD413B.A(+)
N$9: LD413B.C(-) LD423B.A(+)
N$10: LD423B.C(-) LD433B.A(+)
N$11: LD433B.C(-) LD443B.A(+)
N$12: H25.P H27.P LD500FR.C(+) LD501FR.C(+)
N$13: LD443B.C(-) LD453B.A(+)
N$14: LD453B.C(-) LD463B.A(+)
N$106: LD400B.C(-) LD410B.A(+)
N$107: LD410B.C(-) LD420B.A(+)
N$108: LD420B.C(-) LD430B.A(+)
N$109: LD430B.C(-) LD440B.A(+)
N$110: LD440B.C(-) LD450B.A(+)
N$111: LD450B.C(-) LD460B.A(+)
N$112: LD401B.C(-) LD411B.A(+)
N$113: LD411B.C(-) LD421B.A(+)
N$114: LD421B.C(-) LD431B.A(+)
N$115: LD431B.C(-) LD441B.A(+)
N$116: LD441B.C(-) LD451B.A(+)
N$117: LD451B.C(-) LD461B.A(+)
N$118: LD500FR.A(-) LD510FR.C(+)
N$119: LD510FR.A(-) LD520FR.C(+)
N$120: LD520FR.A(-) LD530FR.C(+)
N$121: LD530FR.A(-) LD540FR.C(+)
N$122: LD540FR.A(-) LD550FR.C(+)
N$123: LD550FR.A(-) LD560FR.C(+)
N$124: LD560FR.A(-) LD570FR.C(+)
N$125: LD570FR.A(-) LD580FR.C(+)
N$126: LD580FR.A(-) LD590FR.C(+)
N$127: LD5A0FR.C(+) LD590FR.A(-)
N$128: LD501FR.A(-) LD511FR.C(+)
N$129: LD511FR.A(-) LD521FR.C(+)
N$130: LD521FR.A(-) LD531FR.C(+)
N$131: LD531FR.A(-) LD541FR.C(+)
N$132: LD541FR.A(-) LD551FR.C(+)
N$133: LD551FR.A(-) LD561FR.C(+)
N$134: LD561FR.A(-) LD571FR.C(+)
N$135: LD571FR.A(-) LD581FR.C(+)
N$136: LD581FR.A(-) LD591FR.C(+)
N$137: LD5A1FR.C(+) LD591FR.A(-)
N$145: H24.P H28.P LD460B.C(-) LD461B.C(-) LD462B.C(-) LD463B.C(-)
N$146: H23.P LD400B.A(+) LD401B.A(+) LD402B.A(+) LD403B.A(+)
N$159: H26.P LD5A0FR.A(-) LD5A1FR.A(-)

### Notes on the sheet
- Vf_blue = 2V5..3V5 -> 9..6 LEDs in series, take 7
- ROYAL BLUE: 440..455nm
- HEEL GOED: FOOTPRINT BLAUWE LEDS OK
- Vf_far-red  = 1V4..2V2 -> 17..10 LEDs in series, take 11
- FAR RED: 720..740nm
- FF CHECKEN
- * PINNING | : OK
- * FUNCTIONALITY | : OK
- * PHYSICAL SIZE | : OK
- Light Plate - Royal Blue & Far Red LEDs
- * IN HOUSE | : OK
- * LAID OUT | : OK | 180528 | 1.0
- * COMPS IN LIB | : OK

## Library data of the parts
H1-H4 = 00-own_parts:HOLE_NPTH_3.2MM: Hole, NPTH, 3.2mm
H11 H12 = 00-own_parts:PAD_ROUND_1.6MM: Pad, SMD, round 1.6mm
H17-H28 = 00-own_parts:PAD_ROUND_3.2MM: Pad, SMD, round 3.2mm
LD3A0DR LD3A1DR LD3A2DR LD3A3DR LD3A4DR LD3A5DR LD3A6DR LD3A7DR LD3A8DR LD5A0FR LD5A1FR LD300DR LD301DR LD302DR LD303DR LD304DR LD305DR LD306DR LD307DR LD308DR LD310DR LD311DR LD312DR LD313DR LD314DR LD315DR LD316DR LD317DR LD318DR LD320DR LD321DR LD322DR LD323DR LD324DR LD325DR LD326DR LD327DR LD328DR LD330DR LD331DR LD332DR LD333DR LD334DR LD335DR LD336DR LD337DR LD338DR LD340DR LD341DR LD342DR LD343DR LD344DR LD345DR LD346DR LD347DR LD348DR LD350DR LD351DR LD352DR LD353DR LD354DR LD355DR LD356DR LD357DR LD358DR LD360DR LD361DR LD362DR LD363DR LD364DR LD365DR LD366DR LD367DR LD368DR LD370DR LD371DR LD372DR LD373DR LD374DR LD375DR LD376DR LD377DR LD378DR LD380DR LD381DR LD382DR LD383DR LD384DR LD385DR LD386DR LD387DR LD388DR LD390DR LD391DR LD392DR LD393DR LD394DR LD395DR LD396DR LD397DR LD398DR LD500FR LD501FR LD510FR LD511FR LD520FR LD521FR LD530FR LD531FR LD540FR LD541FR LD550FR LD551FR LD560FR LD561FR LD570FR LD571FR LD580FR LD581FR LD590FR LD591FR = 00-own_parts:LED_SMD_SUNPLUS35_REVERSED: LED, SMD, SunPlus35 Horticulture, 3.5x3.4mm, reversed polarity
LD400B LD401B LD402B LD403B LD410B LD411B LD412B LD413B LD420B LD421B LD422B LD423B LD430B LD431B LD432B LD433B LD440B LD441B LD442B LD443B LD450B LD451B LD452B LD453B LD460B LD461B LD462B LD463B = 00-own_parts:LED_SMD_SUNPLUS35: LED, SMD, SunPlus35 Horticulture, 3.5x3.4mm
NTC = 00-own_parts:RES

## Board
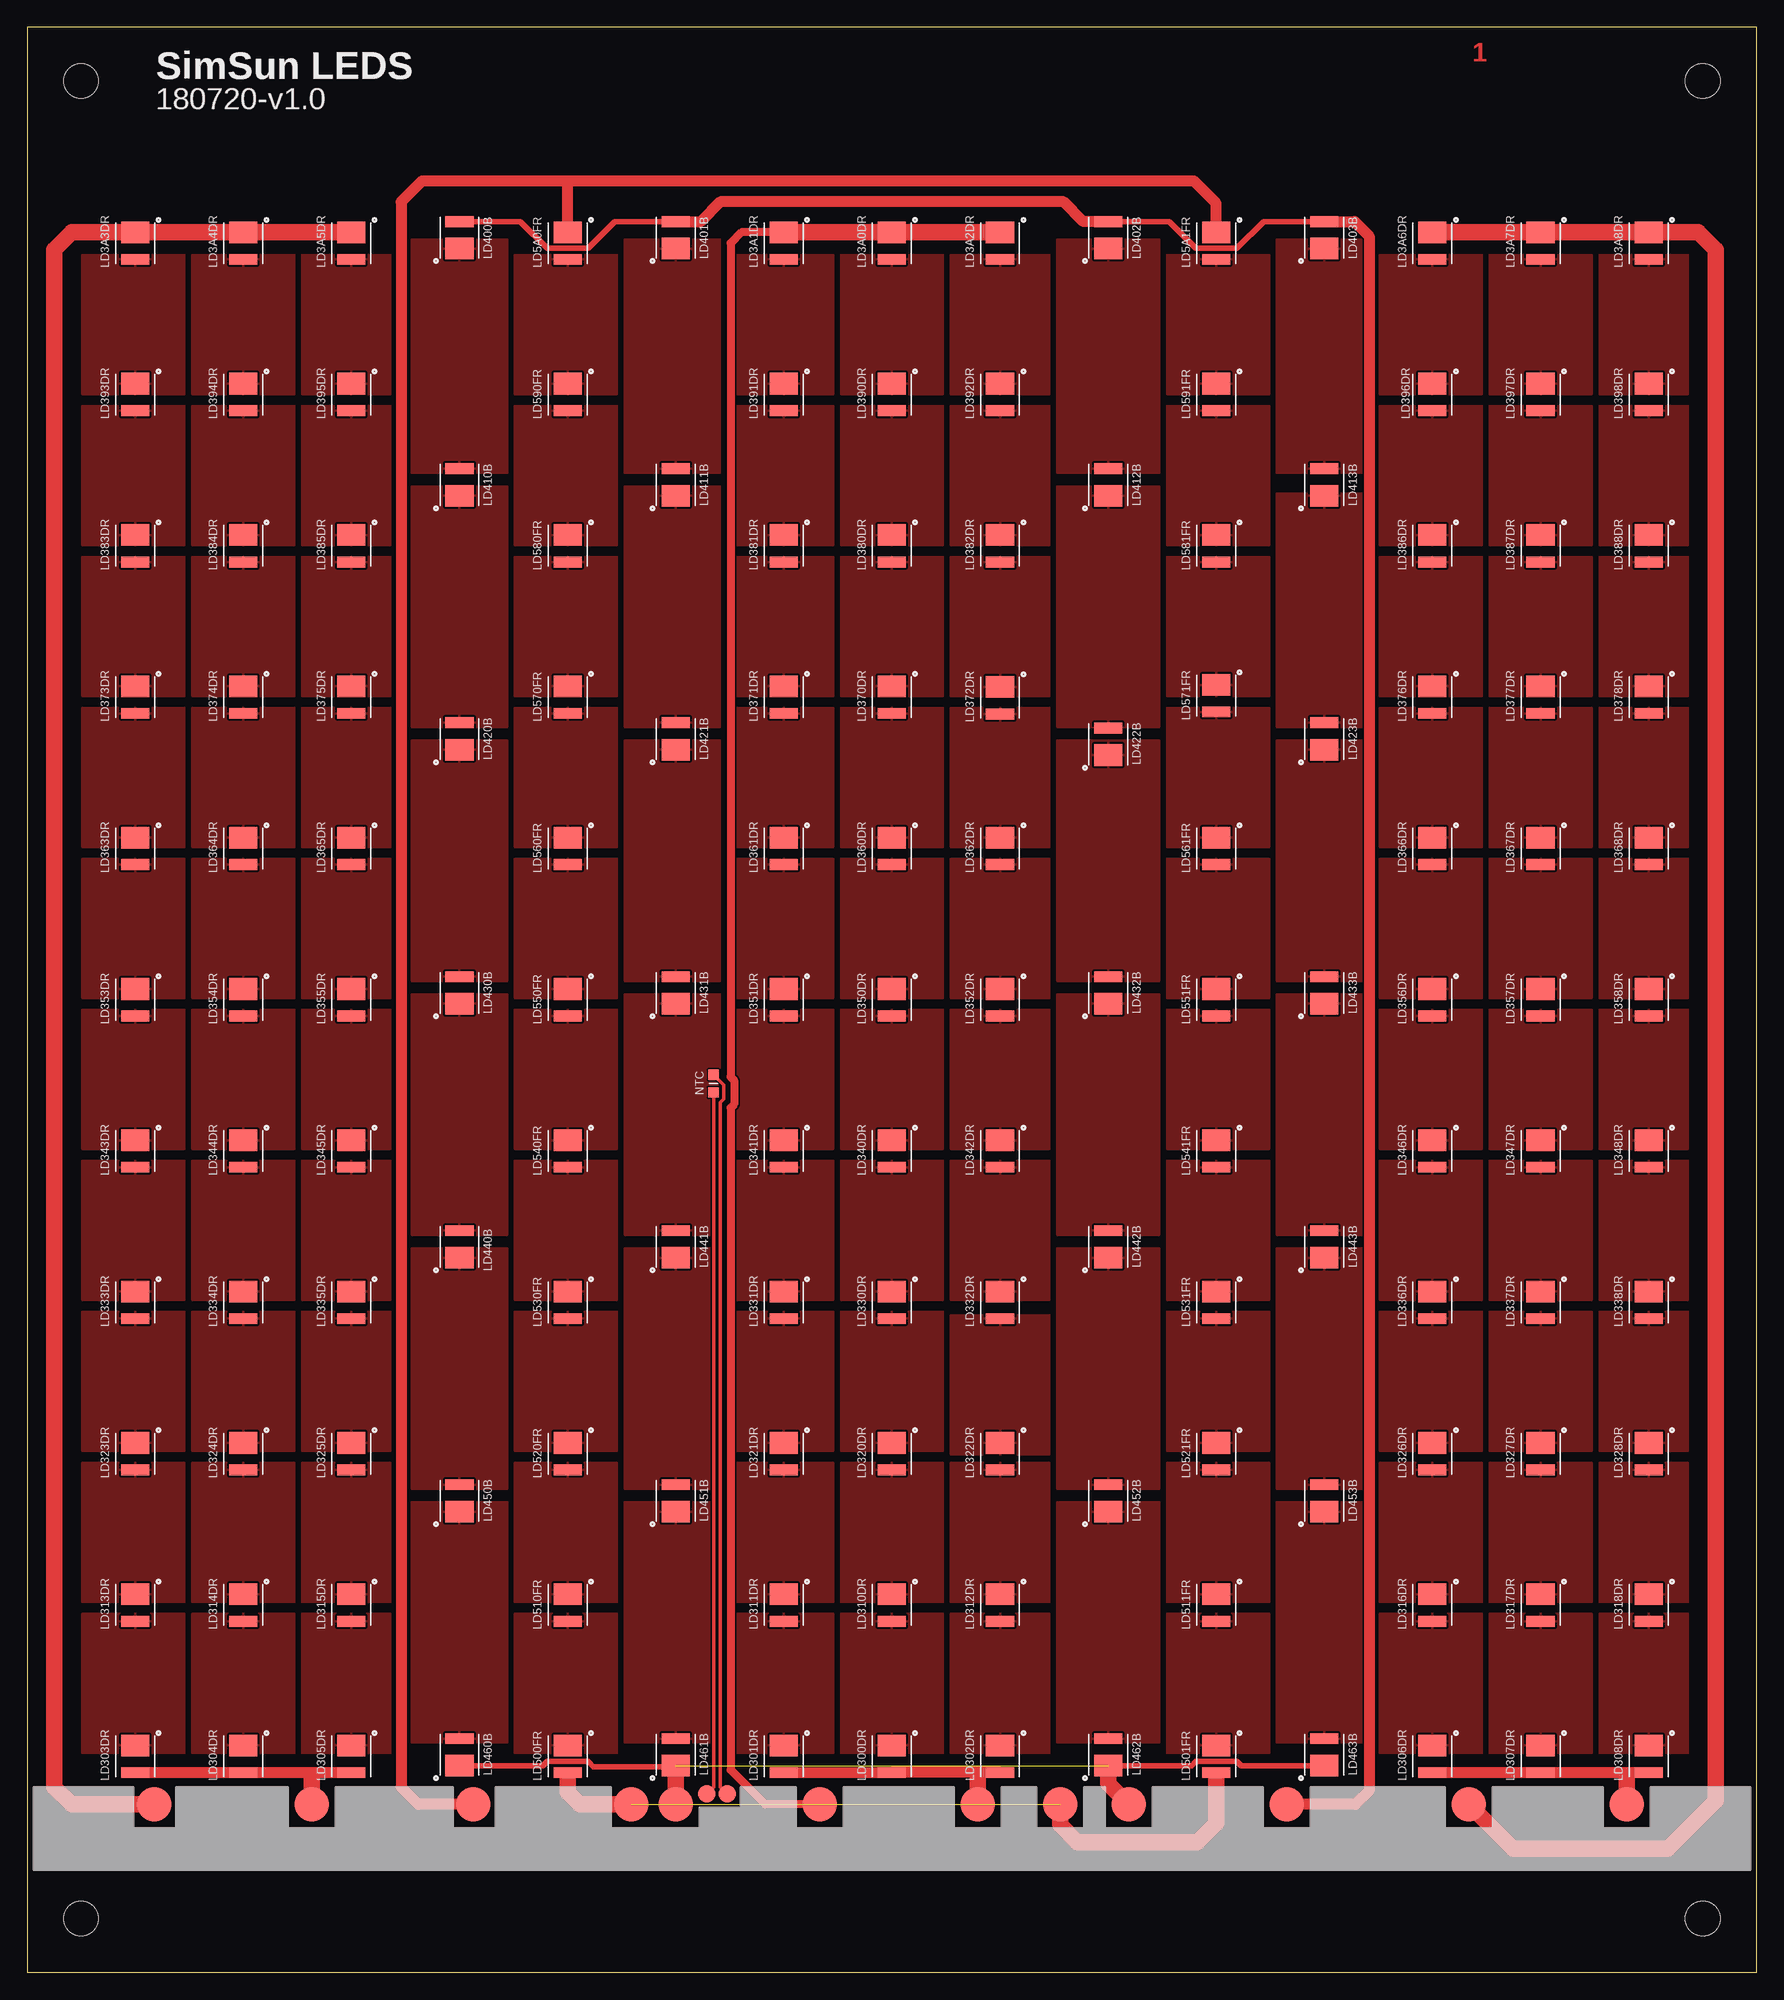
[diagram p4: board, top side]

Size 160 x 180 mm. Coordinates in mm from the lower left corner, seen from the top.
Outline: 0,0 160,0 160,180 0,180 0,0
Copper layers (1*16): Top 0.018mm / dielectric 1.55mm / Bottom 0.018mm
Design rules: minimum track width 0.15mm, minimum drill 0.25mm, track to track 0.15mm, track to pad 0.15mm, pad to pad 0.15mm, via to via 0.15mm, smd to smd 0mil, copper to edge 0.45mm, drill to drill 0.3mm, minimum pad ring 0.2mm, minimum via ring 0.2mm, stop-mask expansion 0.1mm, vias tented up to drill 0.4mm, thermal gap 0.2mm

### Footprints (pad centres in the part's own frame; a part is rotated, then mirrored left to right if it is on the bottom)
HOLE_NPTH_3.2MM = hole 3.2: 0,0
PAD_ROUND_1.6MM = smd 1.6 x 1.6: P 0,0
PAD_ROUND_3.2MM = smd 3.2 x 3.2: P 0,0
LED_SMD_SUNPLUS35_REVERSED = smd 2 x 2.6: A 1,0 | smd 1 x 2.6: C -1.5,0
LED_SMD_SUNPLUS35 = smd 1 x 2.6: A -1.5,0 | smd 2 x 2.6: C 1,0
RES0603 = smd 0.95 x 1: 1 -0.821,0.002; 2 0.822,0

### Placement (x,y rotation side)
H1  155,175 0 top
H2  5,5 0 top
H3  155,5 0 top
H4  5,175 0 top
H11  64.77,16.51 0 top
H12  62.87,16.51 0 top
H17  87.95,15.56 0 top
H18  73.34,15.56 0 top
H19  26.35,15.56 0 top
H20  11.75,15.56 0 top
H21  147.96,15.56 0 top
H22  133.35,15.56 0 top
H23  116.52,15.56 0 top
H24  60.01,15.56 0 top
H25  55.88,15.56 0 top
H26  41.27,15.56 0 top
H27  95.57,15.56 0 top
H28  101.92,15.56 0 top
LD3A0DR  80,160 90 top
LD3A1DR  70,160 90 top
LD3A2DR  90,160 90 top
LD3A3DR  10,160 90 top
LD3A4DR  20,160 90 top
LD3A5DR  30,160 90 top
LD3A6DR  130,160 90 top
LD3A7DR  140,160 90 top
LD3A8DR  150,160 90 top
LD5A0FR  50,160 90 top
LD5A1FR  110,160 90 top
LD300DR  80,20 90 top
LD301DR  70,20 90 top
LD302DR  90,20 90 top
LD303DR  10,20 90 top
LD304DR  20,20 90 top
LD305DR  30,20 90 top
LD306DR  130,20 90 top
LD307DR  140,20 90 top
LD308DR  150,20 90 top
LD310DR  80,34 90 top
LD311DR  70,34 90 top
LD312DR  90,34 90 top
LD313DR  10,34 90 top
LD314DR  20,34 90 top
LD315DR  30,34 90 top
LD316DR  130,34 90 top
LD317DR  140,34 90 top
LD318DR  150,34 90 top
LD320DR  80,48 90 top
LD321DR  70,48 90 top
LD322DR  90,48 90 top
LD323DR  10,48 90 top
LD324DR  20,48 90 top
LD325DR  30,48 90 top
LD326DR  130,48 90 top
LD327DR  140,48 90 top
LD328DR  150,48 90 top
LD330DR  80,62 90 top
LD331DR  70,62 90 top
LD332DR  90,62 90 top
LD333DR  10,62 90 top
LD334DR  20,62 90 top
LD335DR  30,62 90 top
LD336DR  130,62 90 top
LD337DR  140,62 90 top
LD338DR  150,62 90 top
LD340DR  80,76 90 top
LD341DR  70,76 90 top
LD342DR  90,76 90 top
LD343DR  10,76 90 top
LD344DR  20,76 90 top
LD345DR  30,76 90 top
LD346DR  130,76 90 top
LD347DR  140,76 90 top
LD348DR  150,76 90 top
LD350DR  80,90 90 top
LD351DR  70,90 90 top
LD352DR  90,90 90 top
LD353DR  10,90 90 top
LD354DR  20,90 90 top
LD355DR  30,90 90 top
LD356DR  130,90 90 top
LD357DR  140,90 90 top
LD358DR  150,90 90 top
LD360DR  80,104 90 top
LD361DR  70,104 90 top
LD362DR  90,104 90 top
LD363DR  10,104 90 top
LD364DR  20,104 90 top
LD365DR  30,104 90 top
LD366DR  130,104 90 top
LD367DR  140,104 90 top
LD368DR  150,104 90 top
LD370DR  80,118 90 top
LD371DR  70,118 90 top
LD372DR  90,117.94 90 top
LD373DR  10,118 90 top
LD374DR  20,118 90 top
LD375DR  30,118 90 top
LD376DR  130,118 90 top
LD377DR  140,118 90 top
LD378DR  150,118 90 top
LD380DR  80,132 90 top
LD381DR  70,132 90 top
LD382DR  90,132 90 top
LD383DR  10,132 90 top
LD384DR  20,132 90 top
LD385DR  30,132 90 top
LD386DR  130,132 90 top
LD387DR  140,132 90 top
LD388DR  150,132 90 top
LD390DR  80,146 90 top
LD391DR  70,146 90 top
LD392DR  90,146 90 top
LD393DR  10,146 90 top
LD394DR  20,146 90 top
LD395DR  30,146 90 top
LD396DR  130,146 90 top
LD397DR  140,146 90 top
LD398DR  150,146 90 top
LD400B  40,160.5 270 top
LD401B  60,160.5 270 top
LD402B  100,160.5 270 top
LD403B  120,160.5 270 top
LD410B  40,137.63 270 top
LD411B  60,137.63 270 top
LD412B  100,137.63 270 top
LD413B  120,137.63 270 top
LD420B  40,114.14 270 top
LD421B  60,114.14 270 top
LD422B  100,113.64 270 top
LD423B  120,114.14 270 top
LD430B  40,90.64 270 top
LD431B  60,90.64 270 top
LD432B  100,90.64 270 top
LD433B  120,90.64 270 top
LD440B  40,67.14 270 top
LD441B  60,67.14 270 top
LD442B  100,67.14 270 top
LD443B  120,67.14 270 top
LD450B  40,43.63 270 top
LD451B  60,43.63 270 top
LD452B  100,43.63 270 top
LD453B  120,43.63 270 top
LD460B  40,20.14 270 top
LD461B  60,20.14 270 top
LD462B  100,20.14 270 top
LD463B  120,20.14 270 top
LD500FR  50,20 90 top
LD501FR  110,20 90 top
LD510FR  50,34 90 top
LD511FR  110,34 90 top
LD520FR  50,48 90 top
LD521FR  110,48 90 top
LD530FR  50,62 90 top
LD531FR  110,62 90 top
LD540FR  50,76 90 top
LD541FR  110,76 90 top
LD550FR  50,90 90 top
LD551FR  110,90 90 top
LD560FR  50,104 90 top
LD561FR  110,104 90 top
LD570FR  50,118 90 top
LD571FR  110,118.14 90 top
LD580FR  50,132 90 top
LD581FR  110,132 90 top
LD590FR  50,146 90 top
LD591FR  110,146 90 top
NTC  63.5,82.23 270 top

### Tracks (layer width: path | path; a pad name or v marks a point on that pad's centre or on a via)
GND
  Top 0.305: H11.P 64.14,17.14 64.14,80.49 64.45,80.8 64.45,82.1 NTC.1
N$1
  Top 0.305: LD402B.C 100.33,159.5 100.33,159.38
  pour Top: 95.25,138.75 104.78,138.75 104.78,160.34 95.25,160.34
N$2
  pour Top: 95.25,115.25 104.78,115.25 104.78,137.48 95.25,137.48
N$4
  Top 0.305: LD422B.C 100.01,112.64 100.01,112.71
  pour Top: 95.25,91.76 104.78,91.76 104.78,113.98 95.25,113.98
N$5
  pour Top: 95.25,68.26 104.78,68.26 104.78,90.49 95.25,90.49
N$6
  pour Top: 95.25,44.77 104.78,44.77 104.78,66.99 95.25,66.99
N$7
  pour Top: 95.25,21.27 104.78,21.27 104.78,43.5 95.25,43.5
N$8
  pour Top: 115.57,138.75 124.46,138.75 124.46,160.34 115.57,160.34
N$9
  pour Top: 115.57,115.25 124.46,115.25 124.46,136.84 115.57,136.84
N$10
  pour Top: 115.57,91.76 124.46,91.76 124.46,113.98 115.57,113.98
N$11
  pour Top: 115.57,68.26 124.46,68.26 124.46,90.49 115.57,90.49
N$12  (1 unrouted)
  Top 0.254: LD500FR.C 50.01,17.94
  Top 0.508: LD501FR.C 110,17.79 110.01,17.78 | 110.01,17.94 110.01,17.62 109.86,17.46 109.86,16.83
  Top 1.524: H25.P 51.12,15.56 50,16.68 50,17.93 50.01,17.94 | H27.P 95.57,13.65 97.16,12.06 108.27,12.06 110.01,13.81 110.01,17.78 110.01,17.94
N$13
  pour Top: 115.57,44.77 124.46,44.77 124.46,66.99 115.57,66.99
N$14
  pour Top: 115.57,21.27 124.46,21.27 124.46,43.5 115.57,43.5
N$15
  pour Top: 75.25,20.32 84.77,20.32 84.77,33.18 75.25,33.18
N$16
  pour Top: 75.25,34.29 84.77,34.29 84.77,47.15 75.25,47.15
N$17
  pour Top: 75.25,48.26 84.77,48.26 84.77,61.12 75.25,61.12
N$18
  pour Top: 75.25,62.23 84.77,62.23 84.77,75.09 75.25,75.09
N$19
  pour Top: 75.25,76.2 84.77,76.2 84.77,89.06 75.25,89.06
N$20
  pour Top: 75.25,90.17 84.77,90.17 84.77,103.03 75.25,103.03
N$21
  pour Top: 75.25,104.14 84.77,104.14 84.77,117 75.25,117
N$22
  pour Top: 75.25,118.11 84.77,118.11 84.77,130.97 75.25,130.97
N$23
  pour Top: 75.25,132.08 84.77,132.08 84.77,144.94 75.25,144.94
N$24
  pour Top: 75.25,146.05 84.77,146.05 84.77,158.91 75.25,158.91
N$26
  pour Top: 65.41,20.32 74.61,20.32 74.61,33.18 65.41,33.18
N$27
  pour Top: 65.41,34.29 74.61,34.29 74.61,47.15 65.41,47.15
N$28
  pour Top: 65.41,48.26 74.61,48.26 74.61,61.12 65.41,61.12
N$29
  pour Top: 65.41,62.23 74.61,62.23 74.61,75.09 65.41,75.09
N$30
  pour Top: 65.41,76.2 74.61,76.2 74.61,89.06 65.41,89.06
N$31
  pour Top: 65.41,90.17 74.61,90.17 74.61,103.03 65.41,103.03
N$32
  pour Top: 65.41,104.14 74.61,104.14 74.61,117 65.41,117
N$33
  pour Top: 65.41,118.11 74.61,118.11 74.61,130.97 65.41,130.97
N$34
  pour Top: 65.41,132.08 74.61,132.08 74.61,144.94 65.41,144.94
N$35
  pour Top: 65.41,146.05 74.61,146.05 74.61,158.91 65.41,158.91
N$36
  pour Top: 85.41,20.32 94.61,20.32 94.61,33.18 85.41,33.18
N$37
  pour Top: 85.41,34.29 94.61,34.29 94.61,47.15 85.41,47.15
N$38
  pour Top: 85.41,47.94 94.61,47.94 94.61,60.8 85.41,60.8
N$39
  pour Top: 85.41,62.23 94.61,62.23 94.61,75.09 85.41,75.09
N$40
  pour Top: 85.41,76.2 94.61,76.2 94.61,89.06 85.41,89.06
N$41
  pour Top: 85.41,90.17 94.61,90.17 94.61,103.03 85.41,103.03
N$42
  pour Top: 85.41,104.14 94.61,104.14 94.61,117 85.41,117
N$43
  pour Top: 85.41,118.11 94.61,118.11 94.61,130.97 85.41,130.97
N$44
  pour Top: 85.41,132.08 94.61,132.08 94.61,144.94 85.41,144.94
N$45
  pour Top: 85.41,146.05 94.61,146.05 94.61,158.91 85.41,158.91
N$46
  pour Top: 5.08,20.32 14.61,20.32 14.61,33.18 5.08,33.18
N$47
  pour Top: 5.08,34.29 14.61,34.29 14.61,47.15 5.08,47.15
N$48
  pour Top: 5.08,48.26 14.61,48.26 14.61,61.12 5.08,61.12
N$49
  pour Top: 5.08,62.23 14.61,62.23 14.61,75.09 5.08,75.09
N$50
  pour Top: 5.08,76.2 14.61,76.2 14.61,89.06 5.08,89.06
N$51
  pour Top: 5.08,90.17 14.61,90.17 14.61,103.03 5.08,103.03
N$52
  pour Top: 5.08,104.14 14.61,104.14 14.61,117 5.08,117
N$53
  pour Top: 5.08,118.11 14.61,118.11 14.61,130.97 5.08,130.97
N$54
  pour Top: 5.08,132.08 14.61,132.08 14.61,144.94 5.08,144.94
N$55
  pour Top: 5.08,146.05 14.61,146.05 14.61,158.91 5.08,158.91
N$56
  pour Top: 15.24,20.32 24.77,20.32 24.77,33.18 15.24,33.18
N$57
  pour Top: 15.24,34.29 24.77,34.29 24.77,47.15 15.24,47.15
N$58
  pour Top: 15.24,48.26 24.77,48.26 24.77,61.12 15.24,61.12
N$59
  pour Top: 15.24,62.23 24.77,62.23 24.77,75.09 15.24,75.09
N$60
  pour Top: 15.24,76.2 24.77,76.2 24.77,89.06 15.24,89.06
N$61
  pour Top: 15.24,90.17 24.77,90.17 24.77,103.03 15.24,103.03
N$62
  pour Top: 15.24,104.14 24.77,104.14 24.77,117 15.24,117
N$63
  pour Top: 15.24,118.11 24.77,118.11 24.77,130.97 15.24,130.97
N$64
  pour Top: 15.24,132.08 24.77,132.08 24.77,144.94 15.24,144.94
N$65
  pour Top: 15.24,146.05 24.77,146.05 24.77,158.91 15.24,158.91
N$66
  pour Top: 25.4,20.32 33.66,20.32 33.66,33.18 25.4,33.18
N$67
  pour Top: 25.4,34.29 33.66,34.29 33.66,47.15 25.4,47.15
N$68
  pour Top: 25.4,48.26 33.66,48.26 33.66,61.12 25.4,61.12
N$69
  pour Top: 25.4,62.23 33.66,62.23 33.66,75.09 25.4,75.09
N$70
  pour Top: 25.4,76.2 33.66,76.2 33.66,89.06 25.4,89.06
N$71
  pour Top: 25.4,90.17 33.66,90.17 33.66,103.03 25.4,103.03
N$72
  pour Top: 25.4,104.14 33.66,104.14 33.66,117 25.4,117
N$73
  pour Top: 25.4,118.11 33.66,118.11 33.66,130.97 25.4,130.97
N$74
  pour Top: 25.4,132.08 33.66,132.08 33.66,144.94 25.4,144.94
N$75
  pour Top: 25.4,146.05 33.66,146.05 33.66,158.91 25.4,158.91
N$76
  pour Top: 125.09,20.32 134.62,20.32 134.62,33.18 125.09,33.18
N$77
  pour Top: 125.09,34.29 134.62,34.29 134.62,47.15 125.09,47.15
N$78
  pour Top: 125.09,48.26 134.62,48.26 134.62,61.12 125.09,61.12
N$79
  pour Top: 125.09,62.23 134.62,62.23 134.62,75.09 125.09,75.09
N$80
  pour Top: 125.09,76.2 134.62,76.2 134.62,89.06 125.09,89.06
N$81
  pour Top: 125.09,90.17 134.62,90.17 134.62,103.03 125.09,103.03
N$82
  pour Top: 125.09,104.14 134.62,104.14 134.62,117 125.09,117
N$83
  pour Top: 125.09,118.11 134.62,118.11 134.62,130.97 125.09,130.97
N$84
  pour Top: 125.09,132.08 134.62,132.08 134.62,144.94 125.09,144.94
N$85
  pour Top: 125.09,146.05 134.62,146.05 134.62,158.91 125.09,158.91
N$86
  pour Top: 135.25,20.32 144.78,20.32 144.78,33.18 135.25,33.18
N$87
  pour Top: 135.25,34.29 144.78,34.29 144.78,47.15 135.25,47.15
N$88
  pour Top: 135.25,48.26 144.78,48.26 144.78,61.12 135.25,61.12
N$89
  pour Top: 135.25,62.23 144.78,62.23 144.78,75.09 135.25,75.09
N$90
  pour Top: 135.25,76.2 144.78,76.2 144.78,89.06 135.25,89.06
N$91
  pour Top: 135.25,90.17 144.78,90.17 144.78,103.03 135.25,103.03
N$92
  pour Top: 135.25,104.14 144.78,104.14 144.78,117 135.25,117
N$93
  pour Top: 135.25,118.11 144.78,118.11 144.78,130.97 135.25,130.97
N$94
  pour Top: 135.25,132.08 144.78,132.08 144.78,144.94 135.25,144.94
N$95
  pour Top: 135.25,146.05 144.78,146.05 144.78,158.91 135.25,158.91
N$96
  pour Top: 145.41,20.32 153.67,20.32 153.67,33.18 145.41,33.18
N$97
  pour Top: 145.41,34.29 153.67,34.29 153.67,47.15 145.41,47.15
N$98
  pour Top: 145.41,48.26 153.67,48.26 153.67,61.12 145.41,61.12
N$99
  pour Top: 145.41,62.23 153.67,62.23 153.67,75.09 145.41,75.09
N$100
  pour Top: 145.41,76.2 153.67,76.2 153.67,89.06 145.41,89.06
N$101
  pour Top: 145.41,90.17 153.67,90.17 153.67,103.03 145.41,103.03
N$102
  pour Top: 145.41,104.14 153.67,104.14 153.67,117 145.41,117
N$103
  pour Top: 145.41,118.11 153.67,118.11 153.67,130.97 145.41,130.97
N$104
  pour Top: 145.41,132.08 153.67,132.08 153.67,144.94 145.41,144.94
N$105
  pour Top: 145.41,146.05 153.67,146.05 153.67,158.91 145.41,158.91
N$106
  pour Top: 35.56,138.75 44.45,138.75 44.45,160.34 35.56,160.34
N$107
  pour Top: 35.56,115.25 44.45,115.25 44.45,137.48 35.56,137.48
N$108
  pour Top: 35.56,91.76 44.45,91.76 44.45,113.98 35.56,113.98
N$109
  pour Top: 35.56,68.26 44.45,68.26 44.45,90.49 35.56,90.49
N$110
  pour Top: 35.56,44.77 44.45,44.77 44.45,66.99 35.56,66.99
N$111
  pour Top: 35.56,21.27 44.45,21.27 44.45,43.5 35.56,43.5
N$112
  pour Top: 55.24,138.75 64.14,138.75 64.14,160.34 55.24,160.34
N$113
  pour Top: 55.24,115.25 64.14,115.25 64.14,137.48 55.24,137.48
N$114
  pour Top: 55.24,91.76 64.14,91.76 64.14,113.98 55.24,113.98
N$115
  pour Top: 55.24,68.26 64.14,68.26 64.14,90.49 55.24,90.49
N$116
  pour Top: 55.24,44.77 64.14,44.77 64.14,66.99 55.24,66.99
N$117
  pour Top: 55.24,21.27 64.14,21.27 64.14,43.5 55.24,43.5
N$118
  pour Top: 45.09,20.32 54.61,20.32 54.61,33.18 45.09,33.18
N$119
  pour Top: 45.09,34.29 54.61,34.29 54.61,47.15 45.09,47.15
N$120
  pour Top: 45.09,48.26 54.61,48.26 54.61,61.12 45.09,61.12
N$121
  pour Top: 45.09,62.23 54.61,62.23 54.61,75.09 45.09,75.09
N$122
  pour Top: 45.09,76.2 54.61,76.2 54.61,89.06 45.09,89.06
N$123
  pour Top: 45.09,90.17 54.61,90.17 54.61,103.03 45.09,103.03
N$124
  pour Top: 45.09,104.14 54.61,104.14 54.61,117 45.09,117
N$125
  pour Top: 45.09,118.11 54.61,118.11 54.61,130.97 45.09,130.97
N$126
  pour Top: 45.09,132.08 54.61,132.08 54.61,144.94 45.09,144.94
N$127
  pour Top: 45.09,146.05 54.61,146.05 54.61,158.91 45.09,158.91
N$128
  pour Top: 105.41,20.32 114.94,20.32 114.94,33.18 105.41,33.18
N$129
  pour Top: 105.41,34.29 114.94,34.29 114.94,47.15 105.41,47.15
N$130
  pour Top: 105.41,48.26 114.94,48.26 114.94,61.12 105.41,61.12
N$131
  pour Top: 105.41,62.23 114.94,62.23 114.94,75.09 105.41,75.09
N$132
  pour Top: 105.41,76.2 114.94,76.2 114.94,89.06 105.41,89.06
N$133
  pour Top: 105.41,90.17 114.94,90.17 114.94,103.03 105.41,103.03
N$134
  pour Top: 105.41,104.14 114.94,104.14 114.94,117 105.41,117
N$135
  pour Top: 105.41,118.11 114.94,118.11 114.94,130.97 105.41,130.97
N$136
  pour Top: 105.41,132.08 114.94,132.08 114.94,144.94 105.41,144.94
N$137
  pour Top: 105.41,146.05 114.94,146.05 114.94,158.91 105.41,158.91
N$138
  Top 0.762: LD3A1DR.A 66.07,161 65.09,160.02 65.09,82.87 65.41,82.55 65.41,80.33 65.09,80.01 65.09,18.73 68.26,15.56 H18.P
  Top 1.524: LD3A1DR.A LD3A0DR.A LD3A2DR.A
N$142
  Top 1.524: LD3A5DR.A LD3A4DR.A LD3A3DR.A 4.16,161 2.54,159.38 2.54,17.14 4.13,15.56 H20.P
N$144
  Top 1.524: LD3A6DR.A LD3A7DR.A LD3A8DR.A 154.59,161 156.21,159.38 156.21,15.88 151.76,11.43 137.48,11.43 H22.P
N$145  (1 unrouted)
  Top 0.305: 59.91,19.05 LD461B.C
  Top 0.508: LD460B.C 47.71,19.14 48.1,19.53 51.91,19.53 52.39,19.05 59.91,19.05 | LD462B.C 107.72,19.14 108.11,19.53 111.92,19.53 112.31,19.14 LD463B.C
  Top 1.524: LD461B.C H24.P | LD462B.C 100,17.48 H28.P
N$146
  Top 0.508: LD400B.A 45.65,162 48.1,159.54 51.91,159.54 54.37,162 LD401B.A | LD402B.A 105.65,162 108.11,159.54 111.92,159.54 114.38,162 LD403B.A
  Top 1.016: LD403B.A 122.8,162 124.14,160.66 124.14,16.83 122.87,15.56 H23.P | LD402B.A 97.72,162 95.89,163.83 64.14,163.83 62.3,162 LD401B.A
N$148
  Top 0.254: 87.95,17.94 87.95,18.5
  Top 1.016: LD301DR.C LD300DR.C 87.95,18.5 LD302DR.C
  Top 1.524: H17.P 87.95,17.94
N$152
  Top 0.254: 26.35,17.94 26.35,18.5
  Top 1.016: LD303DR.C LD304DR.C 26.35,18.5 LD305DR.C
  Top 1.524: H19.P 26.35,17.94
N$159
  Top 0.508: LD5A0FR.A 50,161.77
  Top 0.762: 50,165.58 49.85,165.74
  Top 1.016: LD5A1FR.A 110,163.69 107.95,165.74 49.85,165.74 36.51,165.74 34.61,163.83 34.61,17.14 36.2,15.56 H26.P | LD5A0FR.A 50,165.58
N$163
  Top 0.254: 147.96,17.94 147.96,18.5
  Top 1.016: LD306DR.C LD307DR.C 147.96,18.5 LD308DR.C
  Top 1.524: H21.P 147.96,17.94
TEMP
  Top 0.305: NTC.2 63.5,17.14 H12.P

### Text on the board
Top: 1
tPlace: SimSun LEDS | 180720-v1.0